# Altium schematic sheet Test PCB.SchDoc
size 500 x 350 mm
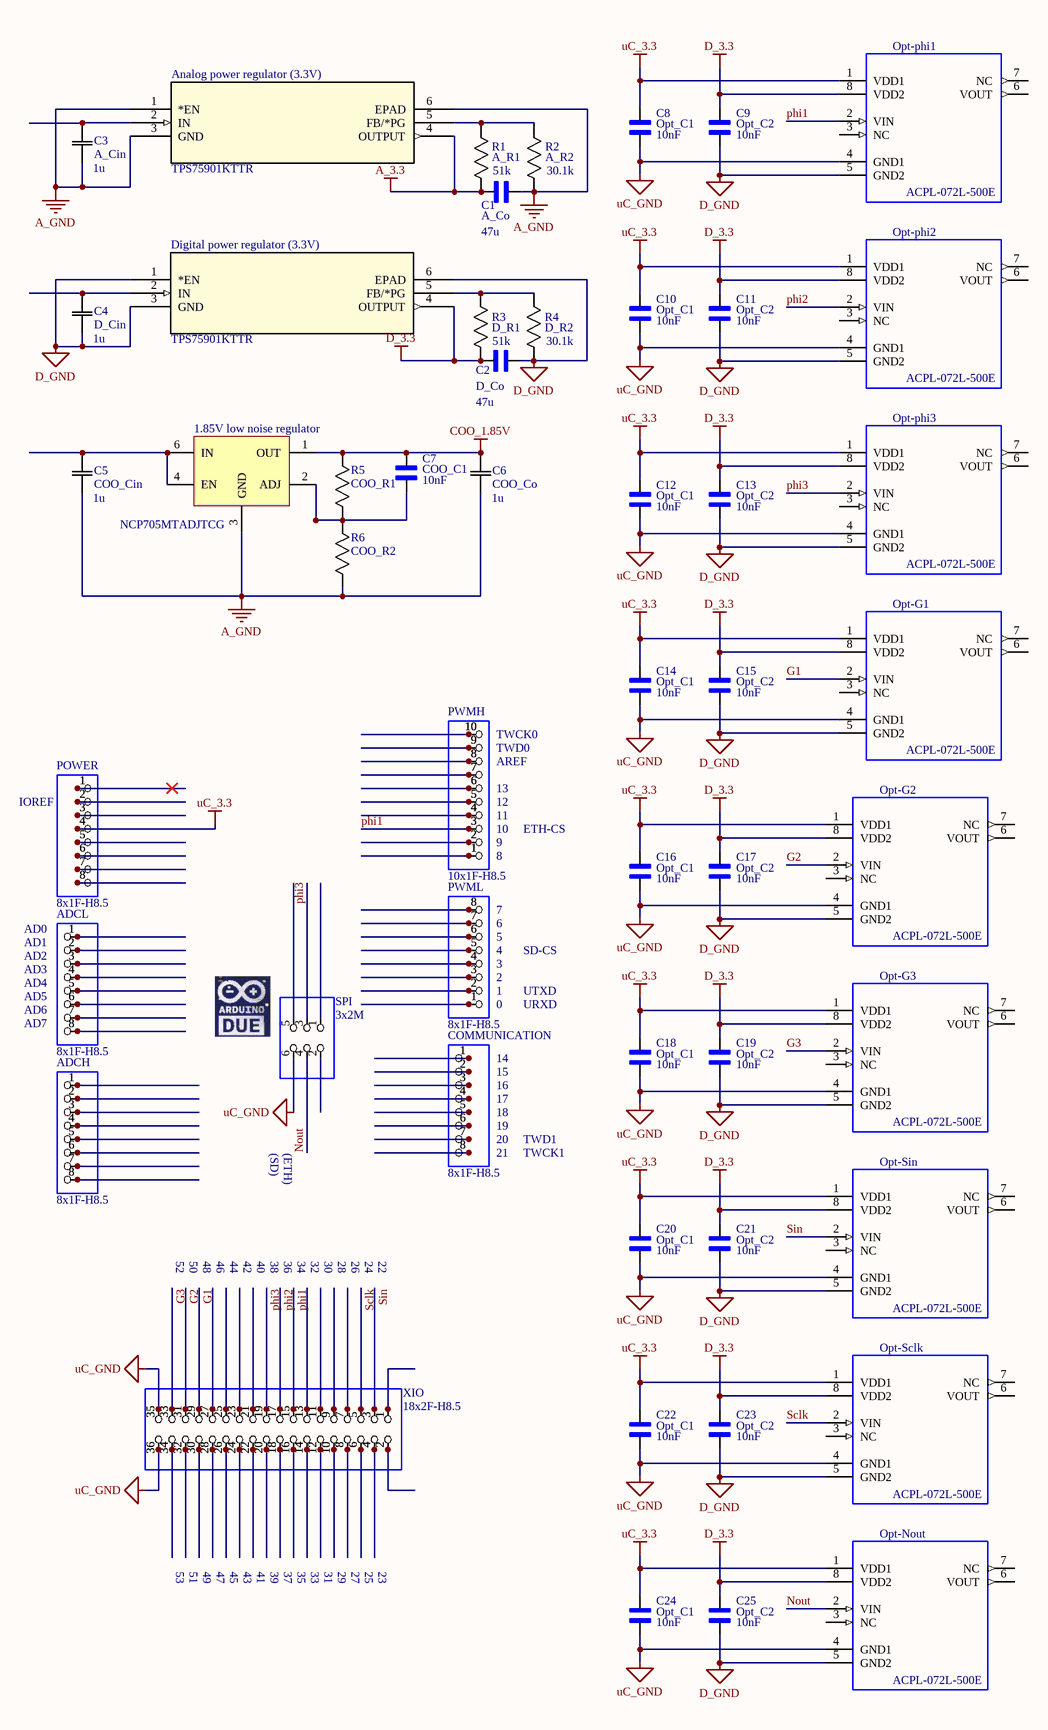
[diagram p0: Test PCB.SchDoc]

## Parts
1.85V_low_noise_regulator  NCP705MTADJTCG  [WDFN6]
ADCH  8x1F-H8.5  [1X08]
ADCL  8x1F-H8.5  [1X08]
Analog_power_regulator_(3.3V)  TPS75901KTTR  [KTT5_6P22X6P86]
C1  A_Co  value 47u  [CAPC1608X9N]
C2  D_Co  value 47u  [CAPC1608X9N]
C3  A_Cin  value 1u  [CAP_GRM_188]
C4  D_Cin  value 1u  [CAP_GRM_188]
C5  COO_Cin  value 1u  [CAP_GRM_188]
C6  COO_Co  value 1u  [CAP_GRM_188]
C7  COO_C1  value 10nF  [CAPC1608X9N]
C8  Opt_C1  value 10nF  [CAPC1608X9N]
C9  Opt_C2  value 10nF  [CAPC1608X9N]
C10  Opt_C1  value 10nF  [CAPC1608X9N]
C11  Opt_C2  value 10nF  [CAPC1608X9N]
C12  Opt_C1  value 10nF  [CAPC1608X9N]
C13  Opt_C2  value 10nF  [CAPC1608X9N]
C14  Opt_C1  value 10nF  [CAPC1608X9N]
C15  Opt_C2  value 10nF  [CAPC1608X9N]
C16  Opt_C1  value 10nF  [CAPC1608X9N]
C17  Opt_C2  value 10nF  [CAPC1608X9N]
C18  Opt_C1  value 10nF  [CAPC1608X9N]
C19  Opt_C2  value 10nF  [CAPC1608X9N]
C20  Opt_C1  value 10nF  [CAPC1608X9N]
C21  Opt_C2  value 10nF  [CAPC1608X9N]
C22  Opt_C1  value 10nF  [CAPC1608X9N]
C23  Opt_C2  value 10nF  [CAPC1608X9N]
C24  Opt_C1  value 10nF  [CAPC1608X9N]
C25  Opt_C2  value 10nF  [CAPC1608X9N]
COMMUNICATION  8x1F-H8.5  [1X08]
Digital_power_regulator_(3.3V)  TPS75901KTTR  [KTT5_6P22X6P86]
Opt-G1  ACPL-072L-500E  [SOIC127P1150X330-8N]
Opt-G2  ACPL-072L-500E  [SOIC127P1150X330-8N]
Opt-G3  ACPL-072L-500E  [SOIC127P1150X330-8N]
Opt-Nout  ACPL-072L-500E  [SOIC127P1150X330-8N]
Opt-phi1  ACPL-072L-500E  [SOIC127P1150X330-8N]
Opt-phi2  ACPL-072L-500E  [SOIC127P1150X330-8N]
Opt-phi3  ACPL-072L-500E  [SOIC127P1150X330-8N]
Opt-Sclk  ACPL-072L-500E  [SOIC127P1150X330-8N]
Opt-Sin  ACPL-072L-500E  [SOIC127P1150X330-8N]
POWER  8x1F-H8.5  [1X08]
PWMH  10x1F-H8.5  [1X10]
PWML  8x1F-H8.5  [1X08]
R1  A_R1  value 51k  [RES_0816]
R2  A_R2  value 30.1k  [RC0603N]
R3  D_R1  value 51k  [RES_0816]
R4  D_R2  value 30.1k  [RC0603N]
R5  COO_R1  [RC0603N]
R6  COO_R2  [RC0603N]
SPI  3x2M  [2X03]
XIO  18x2F-H8.5  [2X18]

## Nets
A_3.3: Analog_power_regulator_(3.3V).4(OUTPUT) C1.2 R1.1
A_GND: 1.85V_low_noise_regulator.3(GND) Analog_power_regulator_(3.3V).1(*EN) Analog_power_regulator_(3.3V).3(GND) Analog_power_regulator_(3.3V).6(EPAD) C1.1 C3.1 C5.1 C6.1 R2.2 R6.2
COO_1.85V: 1.85V_low_noise_regulator.1(OUT) C6.2 C7.1 R5.1
D_3.3: C2.2 C9.1 C11.1 C13.1 C15.1 C17.1 C19.1 C21.1 C23.1 C25.1 Digital_power_regulator_(3.3V).4(OUTPUT) Opt-G1.8(VDD2) Opt-G2.8(VDD2) Opt-G3.8(VDD2) Opt-Nout.8(VDD2) Opt-phi1.8(VDD2) Opt-phi2.8(VDD2) Opt-phi3.8(VDD2) Opt-Sclk.8(VDD2) Opt-Sin.8(VDD2) R3.1
D_GND: C2.1 C4.1 C9.2 C11.2 C13.2 C15.2 C17.2 C19.2 C21.2 C23.2 C25.2 Digital_power_regulator_(3.3V).1(*EN) Digital_power_regulator_(3.3V).3(GND) Digital_power_regulator_(3.3V).6(EPAD) Opt-G1.5(GND2) Opt-G2.5(GND2) Opt-G3.5(GND2) Opt-Nout.5(GND2) Opt-phi1.5(GND2) Opt-phi2.5(GND2) Opt-phi3.5(GND2) Opt-Sclk.5(GND2) Opt-Sin.5(GND2) R4.2
uC_3.3: C8.1 C10.1 C12.1 C14.1 C16.1 C18.1 C20.1 C22.1 C24.1 Opt-G1.1(VDD1) Opt-G2.1(VDD1) Opt-G3.1(VDD1) Opt-Nout.1(VDD1) Opt-phi1.1(VDD1) Opt-phi2.1(VDD1) Opt-phi3.1(VDD1) Opt-Sclk.1(VDD1) Opt-Sin.1(VDD1) POWER.4
uC_GND: C8.2 C10.2 C12.2 C14.2 C16.2 C18.2 C20.2 C22.2 C24.2 Opt-G1.4(GND1) Opt-G2.4(GND1) Opt-G3.4(GND1) Opt-Nout.4(GND1) Opt-phi1.4(GND1) Opt-phi2.4(GND1) Opt-phi3.4(GND1) Opt-Sclk.4(GND1) Opt-Sin.4(GND1) SPI.6 XIO.35 XIO.36
G1: Opt-G1.2(VIN) XIO.29
G2: Opt-G2.2(VIN) XIO.31
G3: Opt-G3.2(VIN) XIO.33
Nout: Opt-Nout.2(VIN) SPI.4
phi1: Opt-phi1.2(VIN) PWMH.3 XIO.15
phi2: Opt-phi2.2(VIN) XIO.17
phi3: Opt-phi3.2(VIN) SPI.3 XIO.19
Sclk: Opt-Sclk.2(VIN) XIO.5
Sin: Opt-Sin.2(VIN) XIO.3
Net1.85V_low_noise_regulator_2: 1.85V_low_noise_regulator.2(ADJ) C7.2 R5.2 R6.1
Net1.85V_low_noise_regulator_4: 1.85V_low_noise_regulator.4(EN) 1.85V_low_noise_regulator.6(IN) C5.2
NetAnalog_power_regulator_(3.3V)_2: Analog_power_regulator_(3.3V).2(IN) C3.2
NetAnalog_power_regulator_(3.3V)_5: Analog_power_regulator_(3.3V).5(FB/*PG) R1.2 R2.1
NetC4_2: C4.2 Digital_power_regulator_(3.3V).2(IN)
NetDigital_power_regulator_(3.3V)_5: Digital_power_regulator_(3.3V).5(FB/*PG) R3.2 R4.1

Not connected (* = marked no-connect by the designer): ADCH 1 2 3 4 5 6 7 8; ADCL 1 2 3 4 5 6 7 8; COMMUNICATION 1 2 3 4 5 6 7 8; Opt-G1 3(NC) 6(VOUT) 7(NC); Opt-G2 3(NC) 6(VOUT) 7(NC); Opt-G3 3(NC) 6(VOUT) 7(NC); Opt-Nout 3(NC) 6(VOUT) 7(NC); Opt-phi1 3(NC) 6(VOUT) 7(NC); Opt-phi2 3(NC) 6(VOUT) 7(NC); Opt-phi3 3(NC) 6(VOUT) 7(NC); Opt-Sclk 3(NC) 6(VOUT) 7(NC); Opt-Sin 3(NC) 6(VOUT) 7(NC); POWER 1* 2 3 5 6 7 8; PWMH 1 2 4 5 6 7 8 9 10; PWML 1 2 3 4 5 6 7 8; SPI 1 2 5; XIO 1 2 4 6 7 8 9 10 11 12 13 14 16 18 20 21 22 23 24 25 26 27 28 30 32 34

## Notes on the sheet
- (near PWMH) 13
- (near PWMH) TWCK0
- (near PWMH) TWD0
- (near PWMH) AREF
- (near POWER) IOREF
- (near PWMH) 8
- (near PWMH) 9
- (near PWMH) 10
- (near PWMH) 11
- (near PWMH) 12
- (near PWMH) ETH-CS
- (near PWML) 6
- (near PWML) 7
- (near ADCL) AD1
- (near ADCL) AD2
- (near ADCL) AD3
- (near ADCL) AD4
- (near ADCL) AD0
- (near PWML) 1
- (near PWML) 2
- (near PWML) 3
- (near PWML) 4
- (near PWML) 5
- (near PWML) SD-CS
- (near PWML) UTXD
- (near ADCL) AD5
- (near ADCL) AD6
- (near ADCL) AD7
- (near PWML) 0
- 14
- (near PWML) URXD
- 15
- (near COMMUNICATION) 16
- (near COMMUNICATION) 17
- (near COMMUNICATION) 18
- (near COMMUNICATION) 19
- (SD)
- (ETH)
- (near COMMUNICATION) 20
- (near COMMUNICATION) 21
- TWCK1
- TWD1
- 52
- 50
- 48
- 46
- 44
- 42
- 40
- 38
- 36
- 34
- 32
- 30
- 28
- 26
- 24
- 22
- 53
- 51
- 49
- 47
- 45
- 43
- 41
- 39
- 37
- 35
- 33
- 31
- 29
- 27
- 25
- 23

## Library data of the parts
1.85V_low_noise_regulator = NCP705MTADJTCG: 500 mA, Ultra-Low  Quiescent Current, IQ 13 A,  Ultra-Low Noise, LDO  Voltage Regulator; Manufacturer: ON Semiconductor; Manufacturer part number: NCP705MTADJTCG; Digi-Key link: https://www.digikey.ca/product-detail/en/on-semiconductor/NCP705MTADJTCG/NCP705MTADJTCGOSCT-ND/8538627
ADCH ADCL COMMUNICATION POWER PWML = PINHD-1X8
Analog_power_regulator_(3.3V) Digital_power_regulator_(3.3V) = TPS75901KTTR: Imported; Vendor: Texas Instruments; Built_By: EMA_UL_Team; C: Copyright (C) 2015 Accelerated Designs. All rights reserved; Manufacturer_Part_Number: TPS75901KTTR; Manufacturer: Texas Instruments; RefDes: RefDes; Type: DEV; Value: Value
C1 C2 = GRM188R60G476ME15D: Multilayer Ceramic Capacitors - 47uF 4V X5R 20% Pad SMD 0603 85C T/R; MF: Murata; Digi-Key_Part_Number: 490-13246-1-ND; MP: GRM188R60G476ME15D; SnapEDA_Link: https://www.snapeda.com/parts/GRM188R60G476ME15D/Murata%2520Electronics%2520North%2520America/view-part/?ref=snap; Package: 0603 Murata; Digi-Key_Purchase_URL: https://www.digikey.ca/product-detail/en/murata-electronics-north-america/GRM188R60G476ME15D/490-13246-1-ND/5877454?utm_source=snapeda&utm_medium=aggregator&utm_campaign=symbol
C3-C6 = GRM188R60J105KA0: Imported; Manufacturer_Part_Number: GRM188R60J105KA01D; Vendor: Murata; Built_By: EMA_UL_Team; Type: DEV; C: Copyright (C) 2015 Accelerated Designs. All rights reserved; RefDes: RefDes
C7-C25 = GRM1885C1H103JA01D: Multilayer Ceramic Capacitor, GRM Series, 0.01 F, 5%, C0G / NP0, 50 V, 0603 [1608 Metric]; MF: Murata; Package: 0603 Murata; Digi-Key_Purchase_URL: https://www.digikey.ca/product-detail/en/murata-electronics-north-america/GRM1885C1H103JA01D/490-9666-1-ND/4934772?utm_source=snapeda&utm_medium=aggregator&utm_campaign=symbol; Digi-Key_Part_Number: 490-9666-1-ND; SnapEDA_Link: https://www.snapeda.com/parts/GRM1885C1H103JA01D/Murata%20Electronics%20North%20America/view-part/?ref=snap; MP: GRM1885C1H103JA01D
Opt-G1-Opt-G3 Opt-Nout Opt-phi1-Opt-phi3 Opt-Sclk Opt-Sin = ACPL-072L-500E: Optocoupler Logic-Out Push-Pull Logic, Buffer-IN 1-CH 8-Pin SOIC T/R; MF: Broadcom; Digi-Key_Purchase_URL: https://www.digikey.ca/product-detail/en/broadcom-limited/ACPL-072L-500E/516-3131-1-ND/4969461?utm_source=snapeda&utm_medium=aggregator&utm_campaign=symbol; MP: ACPL-072L-500E; Package: SO-8 Avago; Digi-Key_Part_Number: 516-3131-1-ND; SnapEDA_Link: https://www.snapeda.com/parts/ACPL-072L-500E/Broadcom/view-part/?ref=snap; Value: *
PWMH = PINHD-1X10
R1 R3 = RR0816P-513-D: Imported; Vendor: Susumu; Built_By: EMA_UL_Team; C: Copyright (C) 2015 Accelerated Designs. All rights reserved; Manufacturer_Part_Number: RR0816P-513-D; RefDes: RefDes; Type: DEV
R2 R4 = RT0603BRD0730K1L: Imported; Vendor: Yageo; Built_By: EMA_UL_Team; C: Copyright (C) 2015 Accelerated Designs. All rights reserved; Manufacturer_Part_Number: RT0603BRD0730K1L; RefDes: RefDes; Type: DEV
R5 = RC0603FR-07130KL: Imported; Vendor: Yageo; Built_By: EMA_UL_Team; Value: 130k; C: Copyright (C) 2015 Accelerated Designs. All rights reserved; Manufacturer_Part_Number: RC0603FR-07130KL; RefDes: RefDes; Type: DEV
R6 = ERJ-3GEY0R00V: Imported; Vendor: Panasonic; Built_By: EMA_UL_Team; Value: 98.8k; C: Copyright (C) 2015 Accelerated Designs. All rights reserved; Manufacturer_Part_Number: ERJ-3GEY0R00V; RefDes: RefDes; Type: DEV
SPI = PINHD-2X3
XIO = PINHD-2X18